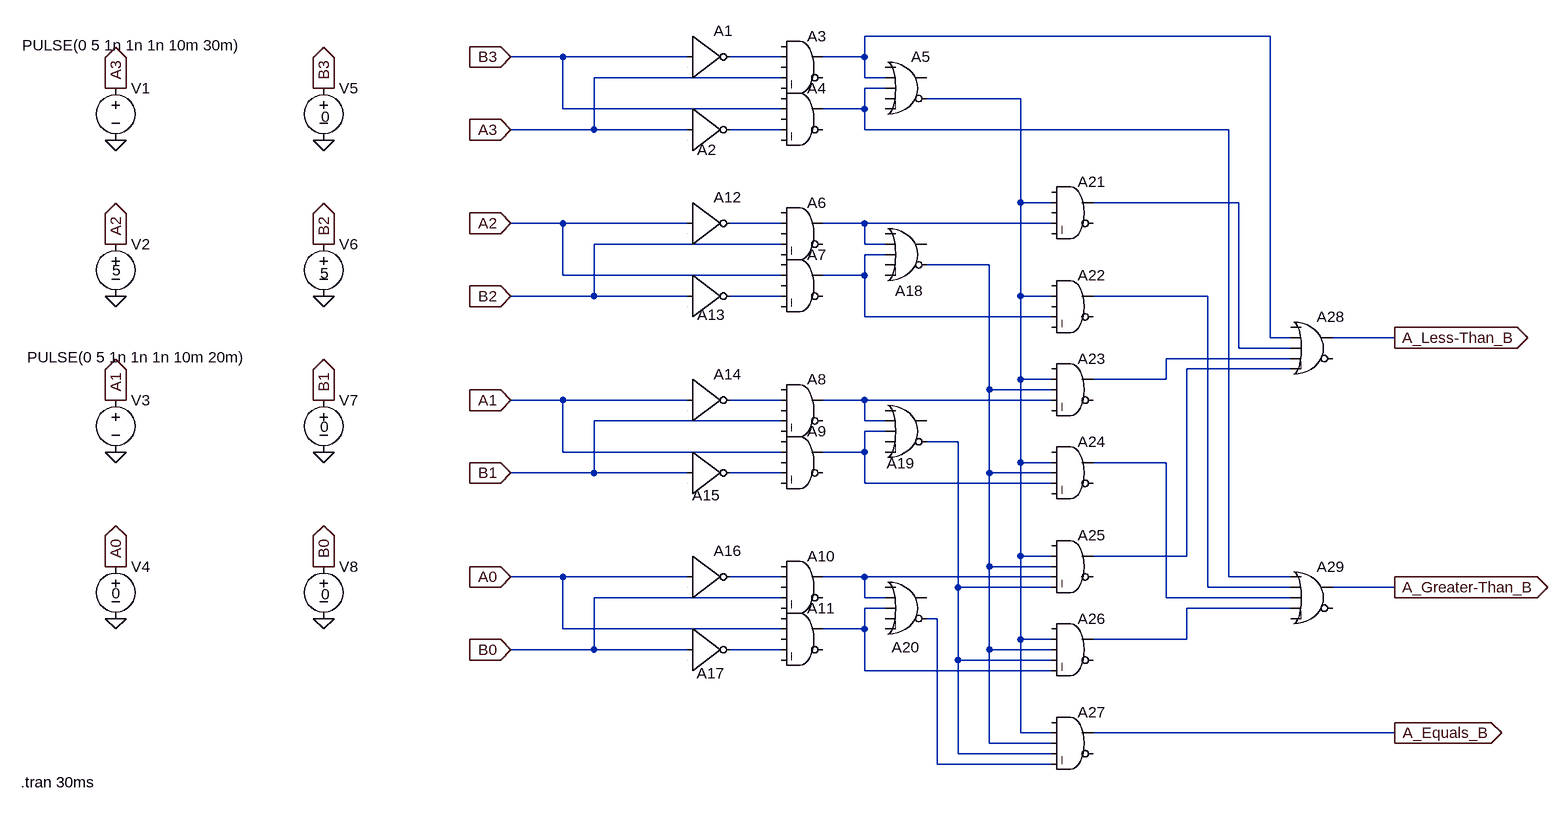
[diagram p0: schematic Signed_Integer_Comparator.asc]
Signed_Integer_Comparator.asc, the LTspice schematic file:
Version 4
SHEET 1 1348 1196
WIRE 880 32 256 32
WIRE -208 64 -288 64
WIRE -16 64 -208 64
WIRE 128 64 48 64
WIRE 256 64 256 32
WIRE 256 64 192 64
WIRE 128 96 -160 96
WIRE 256 96 256 64
WIRE 288 96 256 96
WIRE 288 112 256 112
WIRE 496 128 352 128
WIRE -208 144 -208 64
WIRE 128 144 -208 144
WIRE 256 144 256 112
WIRE 256 144 192 144
WIRE -160 176 -160 96
WIRE -160 176 -288 176
WIRE -16 176 -160 176
WIRE 128 176 48 176
WIRE 256 176 256 144
WIRE 816 176 256 176
WIRE 496 288 496 128
WIRE 544 288 496 288
WIRE 832 288 608 288
WIRE -208 320 -288 320
WIRE -16 320 -208 320
WIRE 128 320 48 320
WIRE 256 320 192 320
WIRE 544 320 256 320
WIRE 128 352 -160 352
WIRE 256 352 256 320
WIRE 288 352 256 352
WIRE 288 368 256 368
WIRE 448 384 352 384
WIRE -208 400 -208 320
WIRE 128 400 -208 400
WIRE 256 400 256 368
WIRE 256 400 192 400
WIRE -160 432 -160 352
WIRE -160 432 -288 432
WIRE -16 432 -160 432
WIRE 128 432 48 432
WIRE 496 432 496 288
WIRE 544 432 496 432
WIRE 784 432 608 432
WIRE 256 464 256 400
WIRE 544 464 256 464
WIRE 880 496 880 32
WIRE 912 496 880 496
WIRE 1072 496 976 496
WIRE 832 512 832 288
WIRE 912 512 832 512
WIRE 912 528 720 528
WIRE 912 544 752 544
WIRE 496 560 496 432
WIRE 544 560 496 560
WIRE 720 560 720 528
WIRE 720 560 608 560
WIRE 448 576 448 384
WIRE 544 576 448 576
WIRE -208 592 -288 592
WIRE -16 592 -208 592
WIRE 128 592 48 592
WIRE 256 592 192 592
WIRE 544 592 256 592
WIRE 128 624 -160 624
WIRE 256 624 256 592
WIRE 288 624 256 624
WIRE 288 640 256 640
WIRE 400 656 352 656
WIRE -208 672 -208 592
WIRE 128 672 -208 672
WIRE 256 672 256 640
WIRE 256 672 192 672
WIRE 496 688 496 560
WIRE 544 688 496 688
WIRE 720 688 608 688
WIRE -160 704 -160 624
WIRE -160 704 -288 704
WIRE -16 704 -160 704
WIRE 128 704 48 704
WIRE 448 704 448 576
WIRE 544 704 448 704
WIRE 256 720 256 672
WIRE 544 720 256 720
WIRE 496 832 496 688
WIRE 544 832 496 832
WIRE 752 832 752 544
WIRE 752 832 608 832
WIRE 448 848 448 704
WIRE 544 848 448 848
WIRE -208 864 -288 864
WIRE -16 864 -208 864
WIRE 128 864 48 864
WIRE 256 864 192 864
WIRE 544 864 256 864
WIRE 816 864 816 176
WIRE 912 864 816 864
WIRE 400 880 400 656
WIRE 544 880 400 880
WIRE 784 880 784 432
WIRE 912 880 784 880
WIRE 1072 880 976 880
WIRE 128 896 -160 896
WIRE 256 896 256 864
WIRE 288 896 256 896
WIRE 720 896 720 688
WIRE 912 896 720 896
WIRE 288 912 256 912
WIRE 912 912 752 912
WIRE 368 928 352 928
WIRE -208 944 -208 864
WIRE 128 944 -208 944
WIRE 256 944 256 912
WIRE 256 944 192 944
WIRE 496 960 496 832
WIRE 544 960 496 960
WIRE 752 960 752 912
WIRE 752 960 608 960
WIRE -160 976 -160 896
WIRE -160 976 -288 976
WIRE -16 976 -160 976
WIRE 128 976 48 976
WIRE 448 976 448 848
WIRE 544 976 448 976
WIRE 400 992 400 880
WIRE 544 992 400 992
WIRE 256 1008 256 944
WIRE 544 1008 256 1008
WIRE 496 1104 496 960
WIRE 544 1104 496 1104
WIRE 1072 1104 608 1104
WIRE 448 1120 448 976
WIRE 544 1120 448 1120
WIRE 400 1136 400 992
WIRE 544 1136 400 1136
WIRE 368 1152 368 928
WIRE 544 1152 368 1152
FLAG -288 64 B3
IOPIN -288 64 In
FLAG -288 176 A3
IOPIN -288 176 In
FLAG -288 320 A2
IOPIN -288 320 In
FLAG -288 432 B2
IOPIN -288 432 In
FLAG -288 592 A1
IOPIN -288 592 In
FLAG -288 704 B1
IOPIN -288 704 In
FLAG -288 864 A0
IOPIN -288 864 In
FLAG -288 976 B0
IOPIN -288 976 In
FLAG 1072 496 A_Less-Than_B
IOPIN 1072 496 Out
FLAG 1072 880 A_Greater-Than_B
IOPIN 1072 880 Out
FLAG 1072 1104 A_Equals_B
IOPIN 1072 1104 Out
FLAG -896 192 0
FLAG -576 192 0
FLAG -576 432 0
FLAG -896 432 0
FLAG -896 672 0
FLAG -576 672 0
FLAG -576 928 0
FLAG -896 928 0
FLAG -896 848 A0
IOPIN -896 848 Out
FLAG -576 848 B0
IOPIN -576 848 Out
FLAG -576 592 B1
IOPIN -576 592 Out
FLAG -896 592 A1
IOPIN -896 592 Out
FLAG -896 352 A2
IOPIN -896 352 Out
FLAG -576 352 B2
IOPIN -576 352 Out
FLAG -896 112 A3
IOPIN -896 112 Out
FLAG -576 112 B3
IOPIN -576 112 Out
SYMBOL Digital\\inv -16 0 R0
SYMATTR InstName A1
SYMBOL Digital\\inv -16 112 R0
WINDOW 0 15 95 Left 2
SYMATTR InstName A2
SYMBOL Digital\\and 160 16 R0
SYMATTR InstName A3
SYMBOL Digital\\and 160 96 R0
SYMATTR InstName A4
SYMBOL Digital\\or 320 48 R0
SYMATTR InstName A5
SYMBOL Digital\\and 160 272 R0
SYMATTR InstName A6
SYMBOL Digital\\and 160 352 R0
SYMATTR InstName A7
SYMBOL Digital\\and 160 544 R0
SYMATTR InstName A8
SYMBOL Digital\\and 160 624 R0
SYMATTR InstName A9
SYMBOL Digital\\and 160 816 R0
SYMATTR InstName A10
SYMBOL Digital\\and 160 896 R0
SYMATTR InstName A11
SYMBOL Digital\\inv -16 256 R0
SYMATTR InstName A12
SYMBOL Digital\\inv -16 368 R0
WINDOW 0 15 93 Left 2
SYMATTR InstName A13
SYMBOL Digital\\inv -16 528 R0
SYMATTR InstName A14
SYMBOL Digital\\inv -16 640 R0
WINDOW 0 7 98 Left 2
SYMATTR InstName A15
SYMBOL Digital\\inv -16 800 R0
SYMATTR InstName A16
SYMBOL Digital\\inv -16 912 R0
WINDOW 0 14 100 Left 2
SYMATTR InstName A17
SYMBOL Digital\\or 320 304 R0
WINDOW 0 -17 120 Left 2
SYMATTR InstName A18
SYMBOL Digital\\or 320 576 R0
WINDOW 0 -30 113 Left 2
SYMATTR InstName A19
SYMBOL Digital\\or 320 848 R0
WINDOW 0 -22 124 Left 2
SYMATTR InstName A20
SYMBOL Digital\\and 576 240 R0
SYMATTR InstName A21
SYMBOL Digital\\and 576 1056 R0
SYMATTR InstName A27
SYMBOL Digital\\and 576 384 R0
SYMATTR InstName A22
SYMBOL Digital\\and 576 512 R0
SYMATTR InstName A23
SYMBOL Digital\\and 576 640 R0
SYMATTR InstName A24
SYMBOL Digital\\and 576 784 R0
SYMATTR InstName A25
SYMBOL Digital\\and 576 912 R0
SYMATTR InstName A26
SYMBOL Digital\\or 944 448 R0
SYMATTR InstName A28
SYMBOL Digital\\or 944 832 R0
SYMATTR InstName A29
SYMBOL voltage -896 96 R0
WINDOW 3 -144 -50 Left 2
WINDOW 123 0 0 Left 0
WINDOW 39 0 0 Left 0
SYMATTR Value PULSE(0 5 1n 1n 1n 10m 30m)
SYMATTR InstName V1
SYMBOL voltage -896 336 R0
WINDOW 3 -5 56 Left 2
WINDOW 123 0 0 Left 0
WINDOW 39 0 0 Left 0
SYMATTR Value 5
SYMATTR InstName V2
SYMBOL voltage -896 576 R0
WINDOW 3 -136 -50 Left 2
WINDOW 123 0 0 Left 0
WINDOW 39 0 0 Left 0
SYMATTR Value PULSE(0 5 1n 1n 1n 10m 20m)
SYMATTR InstName V3
SYMBOL voltage -896 832 R0
WINDOW 3 -6 57 Left 2
WINDOW 123 0 0 Left 0
WINDOW 39 0 0 Left 0
SYMATTR Value 0
SYMATTR InstName V4
SYMBOL voltage -576 96 R0
WINDOW 3 -4 60 Left 2
WINDOW 123 0 0 Left 0
WINDOW 39 0 0 Left 0
SYMATTR Value 0
SYMATTR InstName V5
SYMBOL voltage -576 336 R0
WINDOW 3 -5 61 Left 2
WINDOW 123 0 0 Left 0
WINDOW 39 0 0 Left 0
SYMATTR Value 5
SYMATTR InstName V6
SYMBOL voltage -576 576 R0
WINDOW 3 -5 57 Left 2
WINDOW 123 0 0 Left 0
WINDOW 39 0 0 Left 0
SYMATTR Value 0
SYMATTR InstName V7
SYMBOL voltage -576 832 R0
WINDOW 3 -4 59 Left 2
WINDOW 123 0 0 Left 0
WINDOW 39 0 0 Left 0
SYMATTR Value 0
SYMATTR InstName V8
TEXT -1042 1180 Left 2 !.tran 30ms

The netlist it stands for:
* Signed_Integer_Comparator.asc
A1 B3 0 0 0 0 N002 0 0 BUF
A2 A3 0 0 0 0 N005 0 0 BUF
A3 0 N002 0 A3 0 0 N001 0 AND
A4 0 B3 0 N005 0 0 N003 0 AND
A5 0 N001 N003 0 0 N004 0 0 OR
A6 0 N007 0 B2 0 0 N008 0 AND
A7 0 A2 0 N011 0 0 N009 0 AND
A8 0 N015 0 B1 0 0 N016 0 AND
A9 0 A1 0 N020 0 0 N017 0 AND
A10 0 N021 0 B0 0 0 N022 0 AND
A11 0 A0 0 N026 0 0 N023 0 AND
A12 A2 0 0 0 0 N007 0 0 BUF
A13 B2 0 0 0 0 N011 0 0 BUF
A14 A1 0 0 0 0 N015 0 0 BUF
A15 B1 0 0 0 0 N020 0 0 BUF
A16 A0 0 0 0 0 N021 0 0 BUF
A17 B0 0 0 0 0 N026 0 0 BUF
A18 0 N008 N009 0 0 N010 0 0 OR
A19 0 N016 N017 0 0 N018 0 0 OR
A20 0 N022 N023 0 0 N025 0 0 OR
A21 0 N004 0 N008 0 0 N006 0 AND
A27 0 N004 N010 N018 N025 0 A_Equals_B 0 AND
A22 0 N004 0 N009 0 0 N012 0 AND
A23 0 N004 N010 N016 0 0 N013 0 AND
A24 0 N004 N010 N017 0 0 N019 0 AND
A25 0 N004 N010 N022 N018 0 N014 0 AND
A26 0 N004 N010 N018 N023 0 N024 0 AND
A28 0 N001 N006 N013 N014 0 A_Less-Than_B 0 OR
A29 N003 N012 N019 N024 0 0 A_Greater-Than_B 0 OR
V1 A3 0 PULSE(0 5 1n 1n 1n 10m 30m)
V2 A2 0 5
V3 A1 0 PULSE(0 5 1n 1n 1n 10m 20m)
V4 A0 0 0
V5 B3 0 0
V6 B2 0 5
V7 B1 0 0
V8 B0 0 0
.tran 30ms
.backanno
.end